# Altium schematic sheet power_supplies.SchDoc: Title
size 420 x 297 mm; CheckedBy: -; CompanyName: CERN; DrawnBy: DrawnBy; Organization: CERN; Address1: European Organization for Nuclear Research; Address2: CH-1211 Genčve 23 - Switzerland; Revision: -; SheetNumber: -; SheetTotal: -; EDA_Number: EDA-XXXXX-VX-X; Projet: -; ModifiedBy: -; CreateDate: XX/XX/XXXX; CheckedDate: -; Title2: Title2; DivGrp: TE/MPE; Designer: Designer; ModifiedDate: -
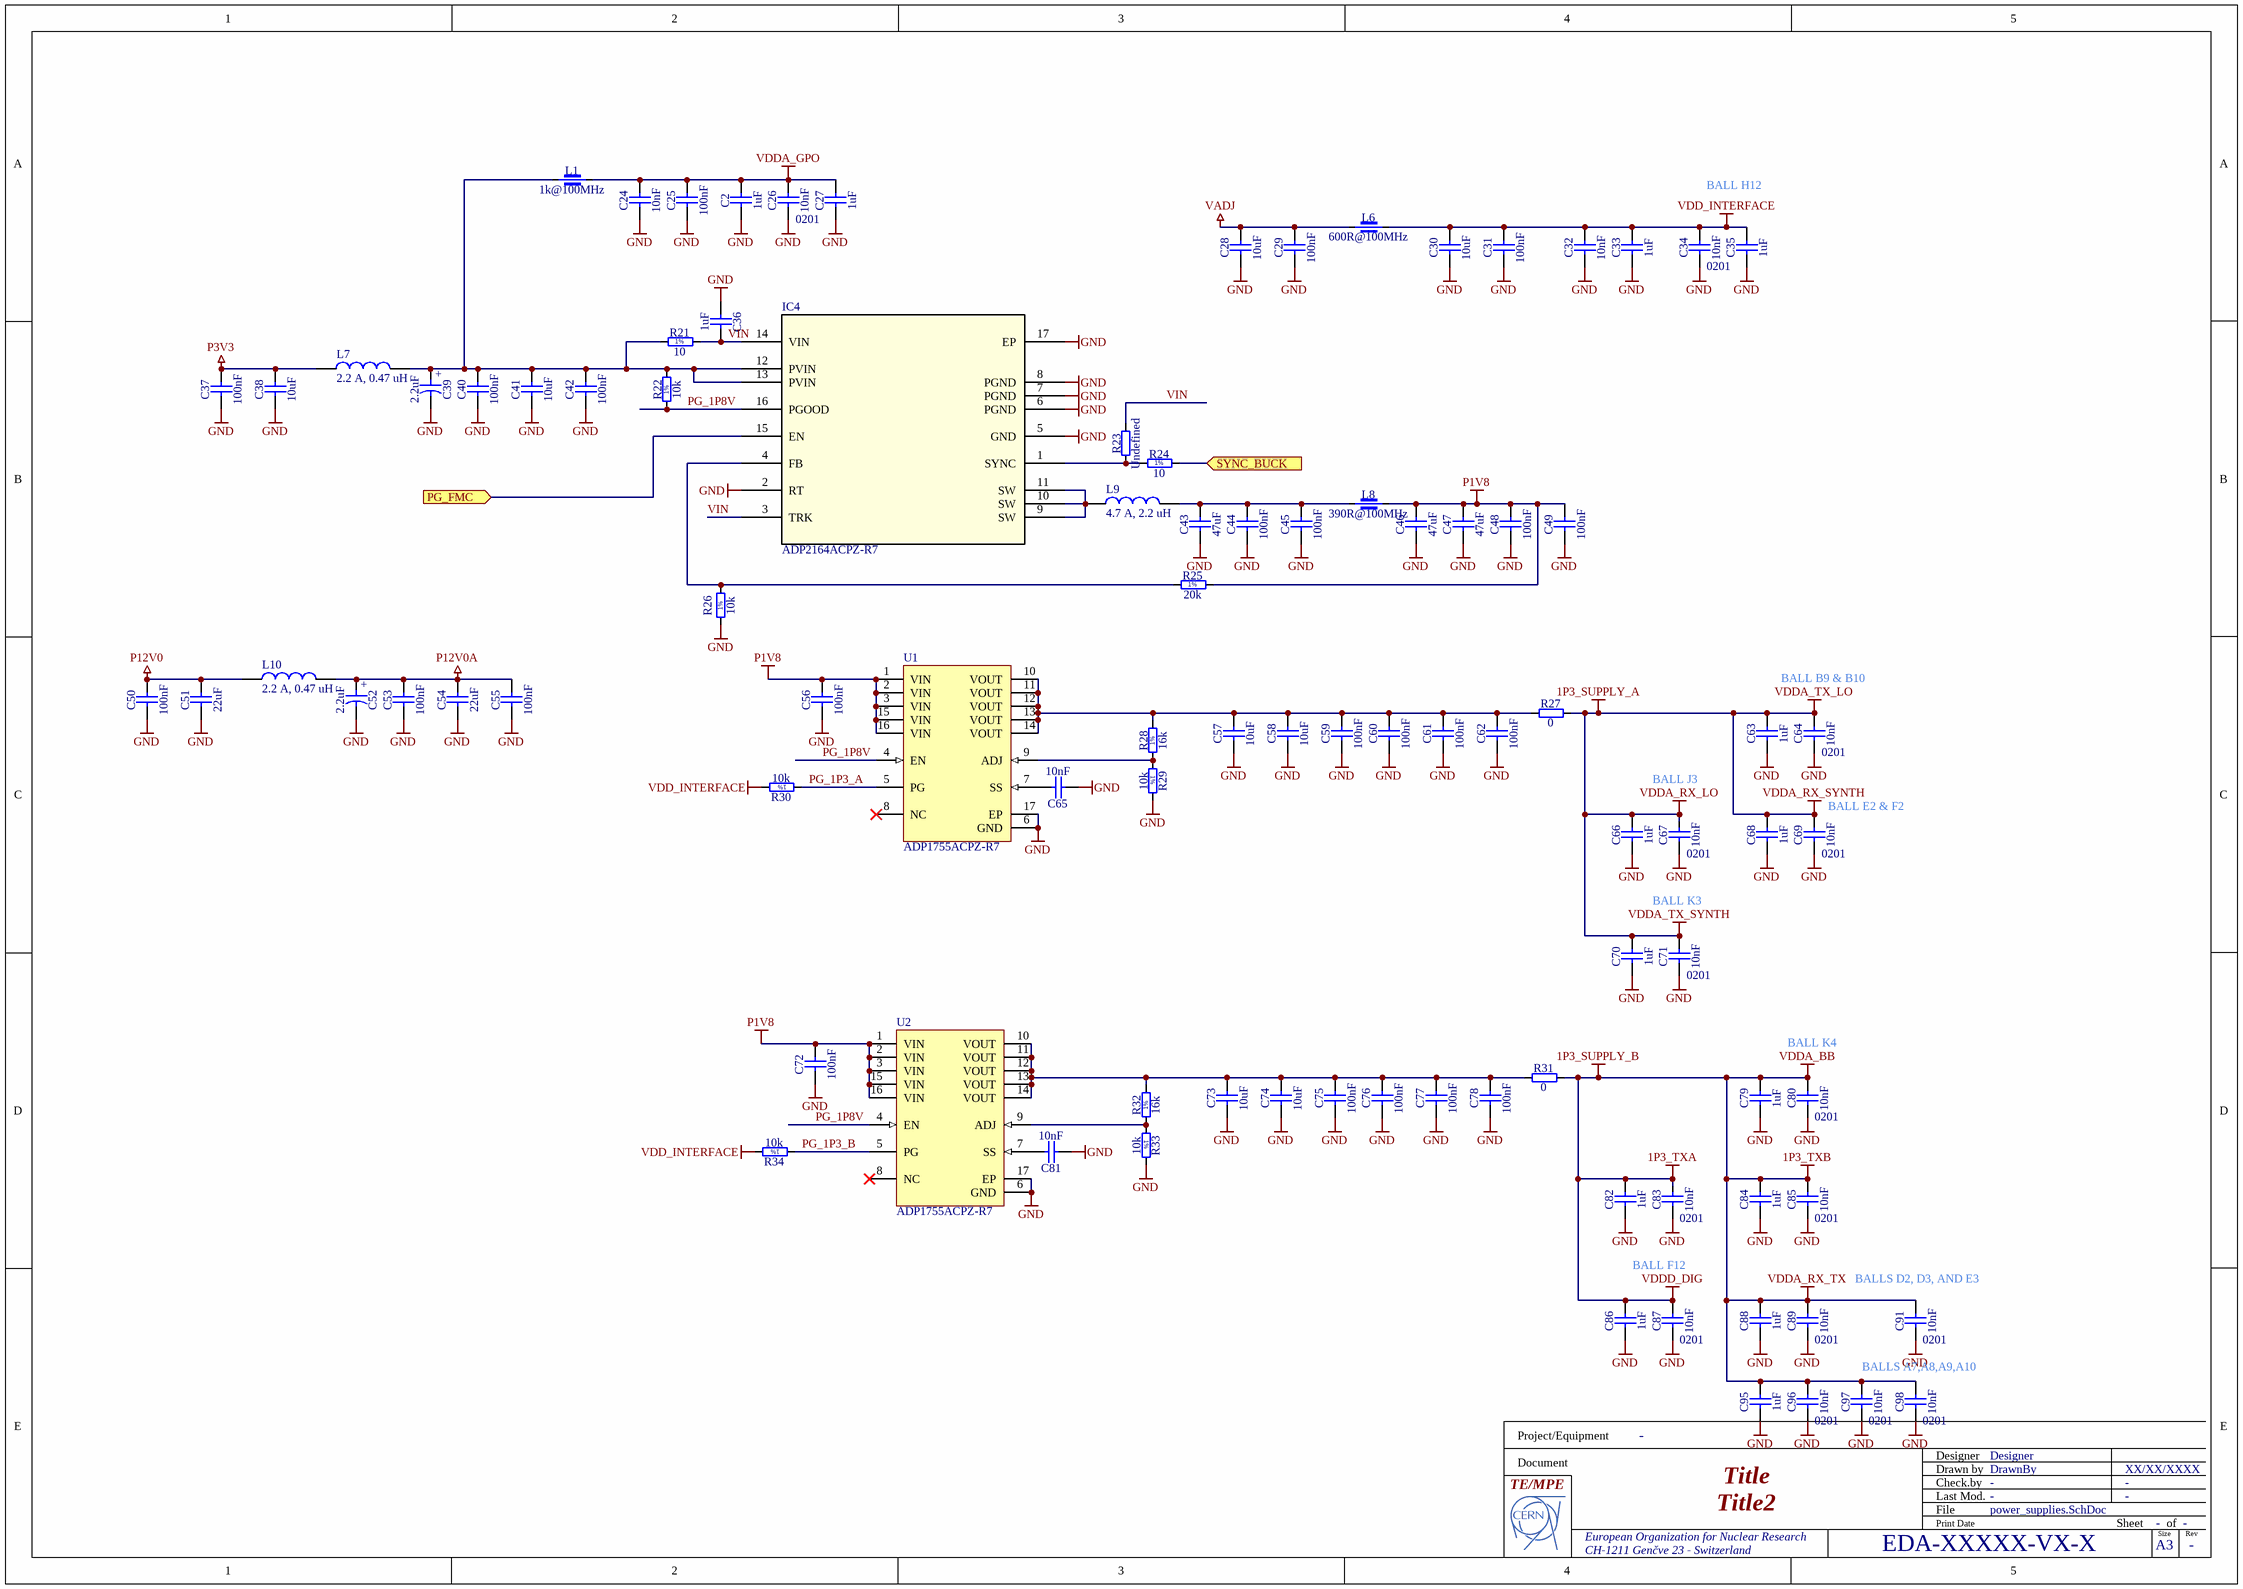
[diagram p0: power_supplies.SchDoc]

## Parts
C2  1uF  [CAPC1005X55N]
C24  10nF  [CAPC1005X55N]
C25  100nF  [CAPC1005X55N]
C26  10nF  Case: 0201  [CAPC0603X33N]
C27  1uF  [CAPC1005X55N]
C28  10uF  [CAPC1608X87N]
C29  100nF  [CAPC1005X55N]
C30  10uF  [CAPC1608X87N]
C31  100nF  [CAPC1005X55N]
C32  10nF  [CAPC1005X55N]
C33  1uF  [CAPC1005X55N]
C34  10nF  Case: 0201  [CAPC0603X33N]
C35  1uF  [CAPC1005X55N]
C36  1uF  [CAPC1005X55N]
C37  100nF  [CAPC1005X55N]
C38  10uF  [CAPC1608X87N]
C39  2.2uF  [CAPMP3216X180N]
C40  100nF  [CAPC1005X55N]
C41  10uF  [CAPC1608X87N]
C42  100nF  [CAPC1005X55N]
C43  47uF  [CAPC3216X180N]
C44  100nF  [CAPC1005X55N]
C45  100nF  [CAPC1005X55N]
C46  47uF  [CAPC3216X180N]
C47  47uF  [CAPC3216X180N]
C48  100nF  [CAPC1005X55N]
C49  100nF  [CAPC1005X55N]
C50  100nF  [CAPC1005X55N]
C51  22uF  [CAPC3216X180N]
C52  2.2uF  [CAPMP3216X180N]
C53  100nF  [CAPC1005X55N]
C54  22uF  [CAPC3216X180N]
C55  100nF  [CAPC1005X55N]
C56  100nF  [CAPC1005X55N]
C57  10uF  [CAPC1608X87N]
C58  10uF  [CAPC1608X87N]
C59  100nF  [CAPC1005X55N]
C60  100nF  [CAPC1005X55N]
C61  100nF  [CAPC1005X55N]
C62  100nF  [CAPC1005X55N]
C63  1uF  [CAPC1005X55N]
C64  10nF  Case: 0201  [CAPC0603X33N]
C65  10nF  [CAPC1005X55N]
C66  1uF  [CAPC1005X55N]
C67  10nF  Case: 0201  [CAPC0603X33N]
C68  1uF  [CAPC1005X55N]
C69  10nF  Case: 0201  [CAPC0603X33N]
C70  1uF  [CAPC1005X55N]
C71  10nF  Case: 0201  [CAPC0603X33N]
C72  100nF  [CAPC1005X55N]
C73  10uF  [CAPC1608X87N]
C74  10uF  [CAPC1608X87N]
C75  100nF  [CAPC1005X55N]
C76  100nF  [CAPC1005X55N]
C77  100nF  [CAPC1005X55N]
C78  100nF  [CAPC1005X55N]
C79  1uF  [CAPC1005X55N]
C80  10nF  Case: 0201  [CAPC0603X33N]
C81  10nF  [CAPC1005X55N]
C82  1uF  [CAPC1005X55N]
C83  10nF  Case: 0201  [CAPC0603X33N]
C84  1uF  [CAPC1005X55N]
C85  10nF  Case: 0201  [CAPC0603X33N]
C86  1uF  [CAPC1005X55N]
C87  10nF  Case: 0201  [CAPC0603X33N]
C88  1uF  [CAPC1005X55N]
C89  10nF  Case: 0201  [CAPC0603X33N]
C91  10nF  Case: 0201  [CAPC0603X33N]
C95  1uF  [CAPC1005X55N]
C96  10nF  Case: 0201  [CAPC0603X33N]
C97  10nF  Case: 0201  [CAPC0603X33N]
C98  10nF  Case: 0201  [CAPC0603X33N]
IC4  ADP2164ACPZ-R7  [CP_16_26]
L1  1k@100MHz  [INDC1005X55N]
L6  600R@100MHz  [INDC1608X75N]
L7  2.2 A, 0.47 uH  [WE-MAIA_2506]
L8  390R@100MHz  [INDC1608X95N]
L9  4.7 A, 2.2 uH  [WE-MAIA_4020]
L10  2.2 A, 0.47 uH  [WE-MAIA_2506]
R21  10  [RESC1608X55N]
R22  10k  [RESC1005X40N]
R23  Undefined  [RESC1608X55N]
R24  10  [RESC1608X55N]
R25  20k  [RESC1005X40N]
R26  10k  [RESC1005X40N]
R27  0  [RESC1608X55N]
R28  16k  [RESC1005X40N]
R29  10k  [RESC1005X40N]
R30  10k  [RESC1005X40N]
R31  0  [RESC1608X55N]
R32  16k  [RESC1005X40N]
R33  10k  [RESC1005X40N]
R34  10k  [RESC1005X40N]
U1  ADP1755ACPZ-R7  [CP-16-4_L]
U2  ADP1755ACPZ-R7  [CP-16-4_L]

## Ports
PG_FMC (in), SYNC_BUCK (in)

## Nets
1P3_SUPPLY_A: C63.2 C64.2 C66.2 C67.2 C68.2 C69.2 C70.2 C71.2 R27.2  [also labelled VDDA_RX_LO, VDDA_RX_SYNTH, VDDA_TX_LO, VDDA_TX_SYNTH]
1P3_SUPPLY_B: C79.2 C80.2 C82.2 C83.2 C84.2 C85.2 C86.2 C87.2 C88.2 C89.2 C91.2 C95.2 C96.2 C97.2 C98.2 R31.2  [also labelled 1P3_TXA, 1P3_TXB, VDDA_BB, VDDA_RX_TX, VDDD_DIG]
GND: C2.1 C24.1 C25.1 C26.1 C27.1 C28.1 C29.1 C30.1 C31.1 C32.1 C33.1 C34.1 C35.1 C36.1 C37.1 C38.1 C39.2 C40.1 C41.1 C42.1 C43.1 C44.1 C45.1 C46.1 C47.1 C48.1 C49.1 C50.1 C51.1 C52.2 C53.1 C54.1 C55.1 C56.1 C57.1 C58.1 C59.1 C60.1 C61.1 C62.1 C63.1 C64.1 C65.1 C66.1 C67.1 C68.1 C69.1 C70.1 C71.1 C72.1 C73.1 C74.1 C75.1 C76.1 C77.1 C78.1 C79.1 C80.1 C81.1 C82.1 C83.1 C84.1 C85.1 C86.1 C87.1 C88.1 C89.1 C91.1 C95.1 C96.1 C97.1 C98.1 IC4.2(RT) IC4.5(GND) IC4.6(PGND) IC4.7(PGND) IC4.8(PGND) IC4.17(EP) R26.1 R29.2 R33.2 U1.6(GND) U1.17(EP) U2.6(GND) U2.17(EP)
P1V8: C46.2 C47.2 C48.2 C49.2 C56.2 C72.2 L8.2 R25.2 U1.1(VIN) U1.2(VIN) U1.3(VIN) U1.15(VIN) U1.16(VIN) U2.1(VIN) U2.2(VIN) U2.3(VIN) U2.15(VIN) U2.16(VIN)
P3V3: C37.2 C38.2 L7.1
P12V0: C50.2 C51.2 L10.1
P12V0A: C52.1 C53.2 C54.2 C55.2 L10.2
VADJ: C28.2 C29.2 L6.1
VDD_INTERFACE: C30.2 C31.2 C32.2 C33.2 C34.2 C35.2 L6.2 R30.2 R34.2
VDDA_GPO: C2.2 C24.2 C25.2 C26.2 C27.2 L1.2
PG_1P3_A: R30.1 U1.5(PG)
PG_1P3_B: R34.1 U2.5(PG)
PG_1P8V: IC4.16(PGOOD) R22.1 U1.4(EN) U2.4(EN)
PG_FMC: IC4.15(EN) ; port PG_FMC
SYNC_BUCK: R24.2 ; port SYNC_BUCK
VIN: C36.2 IC4.3(TRK) IC4.14(VIN) R21.2 R23.2
NetC39_1: C39.1 C40.2 C41.2 C42.2 IC4.12(PVIN) IC4.13(PVIN) L1.1 L7.2 R21.1 R22.2
NetC43_2: C43.2 C44.2 C45.2 L8.1 L9.2
NetC57_2: C57.2 C58.2 C59.2 C60.2 C61.2 C62.2 R27.1 R28.2 U1.10(VOUT) U1.11(VOUT) U1.12(VOUT) U1.13(VOUT) U1.14(VOUT)
NetC65_2: C65.2 U1.7(SS)
NetC73_2: C73.2 C74.2 C75.2 C76.2 C77.2 C78.2 R31.1 R32.2 U2.10(VOUT) U2.11(VOUT) U2.12(VOUT) U2.13(VOUT) U2.14(VOUT)
NetC81_2: C81.2 U2.7(SS)
NetIC4_1: IC4.1(SYNC) R23.1 R24.1
NetIC4_4: IC4.4(FB) R25.1 R26.2
NetIC4_9: IC4.9(SW) IC4.10(SW) IC4.11(SW) L9.1
NetR28_1: R28.1 R29.1 U1.9(ADJ)
NetR32_1: R32.1 R33.1 U2.9(ADJ)

Not connected (* = marked no-connect by the designer): U1 8(NC)*; U2 8(NC)*

## Notes on the sheet
- BALL H12
- BALL B9 & B10
- BALL J3
- (near C69) BALL E2 & F2
- BALL K3
- BALL K4
- BALL F12
- (near C91) BALLS D2, D3, AND E3
- BALLS A7,A8,A9,A10
- Project/Equipment
- Document
- Designer
- Drawn by
- Check.by
- File
- Last Mod.
- Print Date
- Sheet
- Size
- A3
- of
- Rev
- (in symbol CTE3216-18_2.2UF_25V_10%) +
- (in symbol R0402_10K_1%_0.0625W_100PPM) 1%
- (in symbol R0402_16K_1%_0.0625W_100PPM) 1%
- (in symbol R0402_20K_1%_0.0625W_100PPM) 1%
- (in symbol R0603_10R_1%_0.1W_200PPM) 1%

## Library data of the parts
C2 C27 C33 C35 C36 C63 C66 C68 C70 C79 C82 C84 C86 C88 C95 = CC0402_1UF_16V_10%_X5R: Non-polarised capacitor; Part Description: SMD Multilayer Chip Ceramic Capacitor; Manufacturer: GENERIC; Manufacturer1 Part Number: C1005X5R1C105KT; Voltage: 16V; TC: X5R; Tolerance: ±10%; Part Number: CC0402_1UF_16V_10%_X5R; Component Kind: Standard; Component Type: Standard; Pin Count: 2; Value: 1uF; Status: Preferred; Manufacturer Part Number: CC0402_1UF_16V_10%_X5R; Case: 0402; Mounted: Yes; Socket: No; SMD: Yes; Sense: No; Manufacturer1 Example: TDK; Manufacturer1 ComponentHeight: 0.55mm; HelpURL: \\cern.ch\dfs\Applications\Altium\Datasheets\CC0402_X5R_TDK_C.pdf; Author: CERN DEM JLC; CreateDate: 25.10.2012; LatestRevisionDate: 25.10.2012
C24 C32 C65 C81 = CC0402_10NF_16V_10%_X7R: Non-polarised capacitor; Part Description: SMD Multilayer Chip Ceramic Capacitor; Manufacturer: GENERIC; Manufacturer1 Part Number: 223878715636; Voltage: 16V; TC: X7R; Tolerance: ±10%; Part Number: CC0402_10NF_16V_10%_X7R; Component Kind: Standard; Component Type: Standard; Pin Count: 2; Value: 10nF; Status: Not Recommended; Manufacturer Part Number: CC0402_10NF_16V_10%_X7R; Case: 0402; Mounted: Yes; Socket: No; SMD: Yes; Sense: No; Manufacturer1 Example: PHYCOMP; Manufacturer1 ComponentHeight: 0.55mm; HelpURL: \\cern.ch\dfs\Applications\Altium\Datasheets\CC0402_X7R_PHYCOMP.pdf; Author: CERN DEM JLC; CreateDate: 03.12.2007; LatestRevisionDate: 03.12.2007
C25 C29 C31 C37 C40 C42 C44 C45 C48-C50 C53 C55 C56 C59-C62 C72 C75-C78 = CC0402_100NF_16V_10%_X7R: Non-polarised capacitor; Part Description: SMD Multilayer Chip Ceramic Capacitor; Manufacturer: GENERIC; Manufacturer1 Part Number: GRM155R71C104KA88D; Voltage: 16V; TC: X7R; Tolerance: ±10%; Part Number: CC0402_100NF_16V_10%_X7R; Component Kind: Standard; Component Type: Standard; Pin Count: 2; Value: 100nF; Status: Not Recommended; Manufacturer Part Number: CC0402_100NF_16V_10%_X7R; Case: 0402; Mounted: Yes; Socket: No; SMD: Yes; Sense: No; Manufacturer1 Example: MURATA; Manufacturer1 ComponentHeight: 0.55mm; HelpURL: \\cern.ch\dfs\Applications\Altium\Datasheets\CC0402_X7R_MURATA_GRM.pdf; Author: CERN DEM JLC; CreateDate: 05.12.2013; LatestRevisionDate: 03.12.2007
C26 C34 C64 C67 C69 C71 C80 C83 C85 C87 C89 C91 C96-C98 = CC0201_10NF_10V_10%_X5R: Non-polarised capacitor; Part Description: SMD Multilayer Chip Ceramic Capacitor; Manufacturer: GENERIC; Manufacturer1 Part Number: 0201ZD103KAT2A; Voltage: 10V; TC: X5R; Tolerance: ±10%; Part Number: CC0201_10NF_10V_10%_X5R; Component Kind: Standard; Component Type: Standard; Pin Count: 2; Value: 10nF; Status: Not Recommended; Manufacturer Part Number: CC0201_10NF_10V_10%_X5R; Mounted: Yes; Socket: No; SMD: Yes; Sense: No; Manufacturer1 Example: AVX; Manufacturer1 ComponentHeight: 0.33mm; HelpURL: \\cern.ch\dfs\Applications\Altium\Datasheets\CC0201_X5R_AVX.pdf; Author: CERN DEM JLC; CreateDate: 03.12.2007; LatestRevisionDate: 03.12.2007
C28 C30 C38 C41 C57 C58 C73 C74 = CC0603_10UF_6.3V_20%_X5R: Non-polarised capacitor; Part Description: SMD Multilayer Chip Ceramic Capacitor; Manufacturer: GENERIC; Manufacturer1 Part Number: C0603C106M9PAC; Voltage: 6.3V; TC: X5R; Tolerance: ±20%; Part Number: CC0603_10UF_6.3V_20%_X5R; Component Kind: Standard; Component Type: Standard; Pin Count: 2; Value: 10uF; Status: Preferred; Manufacturer Part Number: CC0603_10uF_6.3V_20%_X5R; Case: 0603; Mounted: Yes; Socket: No; SMD: Yes; Sense: No; Manufacturer1 Example: KEMET; Manufacturer1 ComponentHeight: 0.95mm; HelpURL: \\cern.ch\dfs\Applications\Altium\Datasheets\CC0603_X5R_KEMET.pdf; Author: CERN DEM JLC; CreateDate: 03.12.2007; LatestRevisionDate: 03.12.2007
C39 C52 = CTE3216-18_2.2UF_25V_10%: Polarised capacitor; Part Description: Solid Tantalum Chip Capacitor; Manufacturer: GENERIC; Manufacturer1 Part Number: TAJA225K025R; Voltage: 25V; Tolerance: ±10%; Part Number: CTE3216-18_2.2UF_25V_10%; Component Kind: Standard; Component Type: Standard; Pin Count: 2; Value: 2.2uF; Status: Preferred; Manufacturer Part Number: CTE3216-18_2.2UF_25V_10%; Case: A; Mounted: Yes; Socket: No; SMD: Yes; Sense: No; Manufacturer1 Example: AVX; Manufacturer1 ComponentHeight: 1.8mm; HelpURL: \\cern.ch\dfs\Applications\Altium\Datasheets\CTE_AVX_TAJ.pdf; Author: CERN DEM JLC; CreateDate: 26.05.2008; LatestRevisionDate: 26.05.2008
C43 C46 C47 = CC1206_47UF_25V_20%_X5R: Non-polarised capacitor; Part Description: SMD Multilayer Chip Ceramic Capacitor; Manufacturer: GENERIC; Manufacturer1 Part Number: C3216X5R1E476M160AC; Voltage: 25V; TC: X5R; Tolerance: ±20%; Part Number: CC1206_47UF_25V_20%_X5R; Component Kind: Standard; Component Type: Standard; Pin Count: 2; Value: 47uF; Status: None; Manufacturer Part Number: CC1206_47UF_25V_20%_X5R; Case: 1206; Mounted: Yes; Socket: No; SMD: Yes; Sense: No; Manufacturer1 Example: TDK; Manufacturer1 ComponentHeight: 1.8mm; HelpURL: \\cern.ch\dfs\Applications\Altium\Datasheets\CC1206_X5R_TDK_C.pdf; Author: CERN DEM JLC; CreateDate: 20.11.2013; LatestRevisionDate: 14.03.2017
C51 C54 = CC1206_22UF_35V_20%_JB_TDK_C3216JB1V226M160AC: Non-polarised capacitor; Part Description: SMD Multilayer Chip Ceramic Capacitor; Manufacturer: TDK; Voltage: 35V; TC: JB(±10%); Tolerance: ±20%; Part Number: CC1206_22UF_35V_20%_JB_TDK_C3216JB1V226M160AC; Component Kind: Standard; Component Type: Standard; Pin Count: 2; Value: 22uF; Status: None; Manufacturer Part Number: C3216JB1V226M160AC; Case: 1206; Mounted: Yes; Socket: No; SMD: Yes; Sense: No; ComponentHeight: 1.8mm; HelpURL: \\cern.ch\dfs\Applications\Altium\Datasheets\CC1206_TDK_C3216JB1V226M160AC.pdf; Author: CERN DEM JLC; CreateDate: 13.07.2017; LatestRevisionDate: 13.07.2017
IC4 = PM_ADP2164ACPZ-R7: 6.5 V, 4 A, High Efficiency,Step-Down,DC-to-DC Regulator; Vendor: Analog Devices Inc; Built_By: EMA_UL_Team; Manufacturer_Part_Number: ADP2164ACPZ-R7; Copyright: Copyright (C) 2018 Accelerated Designs. All rights reserved; RefDes: RefDes; Type: DEV; Value: Value
L1 = IND0402_MURATA_BLM15HD102SN1: Part Description: SMD EMIFIL Suppression Chip Ferrite Bead; Manufacturer: MURATA; Manufacturer Part Number: BLM15HD102SN1D; Power: 250mA; Resistance: 1.25R; Tolerance: ±25%; Part Number: IND0402_MURATA_BLM15HD102SN1; Component Kind: Standard; Component Type: Standard; Pin Count: 2; Value: 1k@100MHz; Status: None; Case: 0402; Mounted: Yes; Socket: No; SMD: Yes; Sense: No; ComponentHeight: 0.55mm; HelpURL: \\cern.ch\dfs\Applications\Altium\Datasheets\IND0402_MURATA_BLM15H.pdf; Author: CERN DEM JLC; CreateDate: 06.03.2012; LatestRevisionDate: 25.10.2018
L6 = IND0603_TDK_MMZ1608B601CTAH0: Part Description: SMT Chip Bead for Signal Line; Manufacturer: TDK; Power: 500mA; Resistance: 0.4R; Tolerance: ±25%; Part Number: IND0603_TDK_MMZ1608B601CTAH0; Component Kind: Standard; Component Type: Standard; Pin Count: 2; Value: 600R@100MHz; Status: None; Manufacturer Part Number: MMZ1608B601CTAH0; Case: 0603; Mounted: Yes; Socket: No; SMD: Yes; Sense: No; ComponentHeight: 0.75mm; HelpURL: \\cern.ch\dfs\Applications\Altium\Datasheets\IND0603_TDK_MMZ1608.pdf; Author: CERN DEM JMW; CreateDate: 21.04.2009; LatestRevisionDate: 25.10.2018
L7 L10 = 784383210047: WE-MAIA SMD Power Inductor, size 2506, 2.2 A, 0.47 uH; Rated Current: 2.2 A; Inductance: 0.47 uH; DC Resistance max.: 95 mOhm; ComponentLink1Description: Manufacturer; ComponentLink1URL: http://www.we-online.de; ComponentLink2Description: Datasheet; ComponentLink2URL: http://katalog.we-online.de/pbs/datasheet/784383210047.pdf; Part Number: 784383210047; Published Date: Nov. 2017; Publisher: Wurth Elektronik; Size: 2506; Operating Temperature: -40 to 125 degC
L8 = IND0603_TDK_MPZ1608R391A: Part Description: SMT Chip Bead for Power Line; Manufacturer: TDK; Power: 1.2A; Resistance: 0.12R; Tolerance: ±25%; Part Number: IND0603_TDK_MPZ1608R391A; Component Kind: Standard; Component Type: Standard; Pin Count: 2; Value: 390R@100MHz; Status: None; Manufacturer Part Number: MPZ1608R391A; Case: 0603; Mounted: Yes; Socket: No; SMD: Yes; Sense: No; ComponentHeight: 0.95mm; HelpURL: \\cern.ch\dfs\Applications\Altium\Datasheets\IND0603_TDK_MPZ1608.pdf; Author: CERN DEM JLC; CreateDate: 02.12.2009; LatestRevisionDate: 25.10.2018
L9 = 78438356022: WE-MAIA SMD Power Inductor, size 4020, 4.7 A, 2.2 uH; Rated Current: 4.7 A; Inductance: 2.2 uH; DC Resistance max.: 35 mOhm; ComponentLink1Description: Manufacturer; ComponentLink1URL: http://www.we-online.de; ComponentLink2Description: Datasheet; ComponentLink2URL: http://katalog.we-online.de/pbs/datasheet/78438356022.pdf; Part Number: 78438356022; Published Date: Nov. 2017; Publisher: Wurth Elektronik; Size: 4020; Operating Temperature: -40 to 125 degC
R21 R24 = R0603_10R_1%_0.1W_200PPM: Resistor - 1%; Part Description: General Purpose Thick Film Chip Resistor; Manufacturer: GENERIC; Manufacturer1 Part Number: NRC06F10R0TRF; Power: 0.1W; TC: ±200ppm/°C; PressFit: No; Part Number: R0603_10R_1%_0.1W_200PPM; Component Kind: Standard; Component Type: Standard; Pin Count: 2; Value: 10; Status: Preferred; Tolerance: ±1%; Manufacturer Part Number: R0603_10R_1%_0.1W_200PPM; Case: 0603; Mounted: Yes; Sense: No; Socket: No; SMD: Yes; Manufacturer1 Example: NIC COMPONENT; Manufacturer1 ComponentHeight: 0.55mm; HelpURL: \\cern.ch\dfs\Applications\Altium\Datasheets\R0603_NIC_NRC.pdf; Author: CERN DEM JLC; CreateDate: 03.12.2007; LatestRevisionDate: 24.06.2009
R22 R26 R29 R30 R33 R34 = R0402_10K_1%_0.0625W_100PPM: Resistor - 1%; Part Description: General Purpose Thick Film Chip Resistor; Manufacturer: GENERIC; Manufacturer1 Part Number: 232270671003L; TC: ±100ppm/°C; PressFit: No; Part Number: R0402_10K_1%_0.0625W_100PPM; Component Kind: Standard; Component Type: Standard; Pin Count: 2; Value: 10k; Status: Not Recommended; Power: 0.0625W; Tolerance: ±1%; Manufacturer Part Number: R0402_10K_1%_0.0625W_100PPM; Case: 0402; Mounted: Yes; Sense: No; Socket: No; SMD: Yes; Manufacturer1 Example: YAGEO PHYCOMP; Manufacturer1 ComponentHeight: 0.4mm; HelpURL: \\cern.ch\dfs\Applications\Altium\Datasheets\R0402_Phycomp_RC0402.pdf; Author: CERN DEM JLC; CreateDate: 03.12.2007; LatestRevisionDate: 17.10.2012
R23 = R0603_NO-VALUE: Resistor; Part Description: Reserved Footprint For a 0603 (1608) Chip Resistor; PressFit: No; Mounted: No; Part Number: R0603_NO-VALUE; Component Kind: Standard; Component Type: Standard; Pin Count: 2; Value: Undefined; Status: None; Manufacturer: Undefined; Manufacturer Part Number: R0603_NO-VALUE; Case: 0603; Sense: No; Socket: No; SMD: Yes; Manufacturer1 Example: Undefined; Manufacturer1 Part Number: Undefined; Manufacturer1 ComponentHeight: Undefined; HelpURL: Undefined; Author: CERN DEM JLC; CreateDate: 03.12.2007; LatestRevisionDate: 13.03.2008
R25 = R0402_20K_1%_0.0625W_100PPM: Resistor - 1%; Part Description: General Purpose Thick Film Chip Resistor; Manufacturer: GENERIC; Manufacturer1 Part Number: 232270672003L; TC: ±100ppm/°C; PressFit: No; Part Number: R0402_20K_1%_0.0625W_100PPM; Component Kind: Standard; Component Type: Standard; Pin Count: 2; Value: 20k; Status: Not Recommended; Power: 0.0625W; Tolerance: ±1%; Manufacturer Part Number: R0402_20K_1%_0.0625W_100PPM; Case: 0402; Mounted: Yes; Sense: No; Socket: No; SMD: Yes; Manufacturer1 Example: YAGEO PHYCOMP; Manufacturer1 ComponentHeight: 0.4mm; HelpURL: \\cern.ch\dfs\Applications\Altium\Datasheets\R0402_Phycomp_RC0402.pdf; Author: CERN DEM JLC; CreateDate: 03.12.2007; LatestRevisionDate: 17.10.2012
R27 R31 = R0603_0R_JUMPER: Resistor; Part Description: 1A (0.05R Max DC Resistance) Zero Ohm Jumper; Manufacturer: GENERIC; Manufacturer1 Part Number: NRC06Z0; PressFit: No; Part Number: R0603_0R_JUMPER; Component Kind: Standard; Component Type: Standard; Pin Count: 2; Value: 0; Status: Preferred; Manufacturer Part Number: R0603_0R_JUMPER; Case: 0603; Mounted: Yes; Sense: No; Socket: No; SMD: Yes; Manufacturer1 Example: NIC COMPONENT; Manufacturer1 ComponentHeight: 0.55mm; HelpURL: \\cern.ch\dfs\Applications\Altium\Datasheets\R0603_NIC_NRC.pdf; Author: CERN DEM JLC; CreateDate: 03.12.2007; LatestRevisionDate: 13.03.2008
R28 R32 = R0402_16K_1%_0.0625W_100PPM: Resistor - 1%; Part Description: General Purpose Thick Film Chip Resistor; Manufacturer: GENERIC; Manufacturer1 Part Number: 232270671603L; TC: ±100ppm/°C; PressFit: No; Part Number: R0402_16K_1%_0.0625W_100PPM; Component Kind: Standard; Component Type: Standard; Pin Count: 2; Value: 16k; Status: Not Recommended; Power: 0.0625W; Tolerance: ±1%; Manufacturer Part Number: R0402_16K_1%_0.0625W_100PPM; Case: 0402; Mounted: Yes; Sense: No; Socket: No; SMD: Yes; Manufacturer1 Example: YAGEO PHYCOMP; Manufacturer1 ComponentHeight: 0.4mm; HelpURL: \\cern.ch\dfs\Applications\Altium\Datasheets\R0402_Phycomp_RC0402.pdf; Author: CERN DEM JLC; CreateDate: 03.12.2007; LatestRevisionDate: 17.10.2012
U1 U2 = CMP-0786-00436-1: 1.2 A, Low VIN, Low Dropout Linear Regulator, 1.6 to 3.6 V Vin, 0.75 to 3 V Vout, Industrial, 16-pin QFN (CP-16-4), Reel; Manufacturer: Analog Devices; Vin (min) (V): 1.6; Vin (max) (V): 3.6; Vout Adjustable Range: 0.75V to 3.3V; Iout max: 1.2A; Supply Current IGND @ Small Load: 90uA; PackageVersion: 010606-0, 01/2006; ComponentLink3URL: http://www.analog.com/static/imported-files/packages/46009454504174339653421710019CP_16_4.pdf; ComponentLink4URL: Product URL:http://www.analog.com/en/ADP1755/productSearch.html; ComponentLink1Description: Manufacturer URL; Packing: Reel; PackageDescription: 16-Pin Lead Frame Chip Scale Package, Body 4 x 4 mm, Pitch 0.65 mm; ComponentLink2URL: http://www.analog.com/static/imported-files/data_sheets/ADP1754_1755.pdf; PackageReference: CP-16-4; DatasheetVersion: Rev. D; ComponentLink4Description: URL Link1; Code_JEDEC: MO-220-VGGC; PartNumber: ADP1755ACPZ-R7; ComponentLink3Description: Package Specification; Mounting Technology: Surface Mount; ComponentLink1URL: http://www.analog.com/en/index.html; ComponentLink2Description: Datasheet